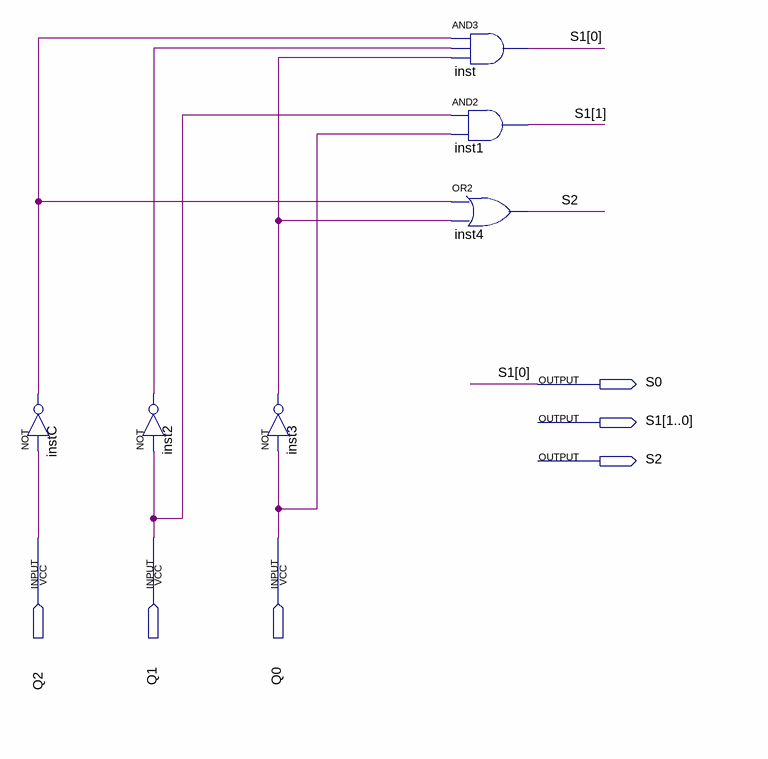
[diagram p0: schematic sheet]
// Quartus schematic S_C2.bdf as structural Verilog: 6 symbols, 6 pins
module S_C2 (
  input  Q2,
  input  Q1,
  input  Q0,
  output S0,
  output [1:0] S1,
  output S2
);

  wire inst2_out, inst3_out, instC_out;

  not instC (instC_out, Q2);
  not inst2 (inst2_out, Q1);
  not inst3 (inst3_out, Q0);
  and inst (S0, instC_out, inst2_out, inst3_out);
  and inst1 (S1[1], Q1, Q0);
  or inst4 (S2, instC_out, inst3_out);

  assign S1[0] = S0;
endmodule
